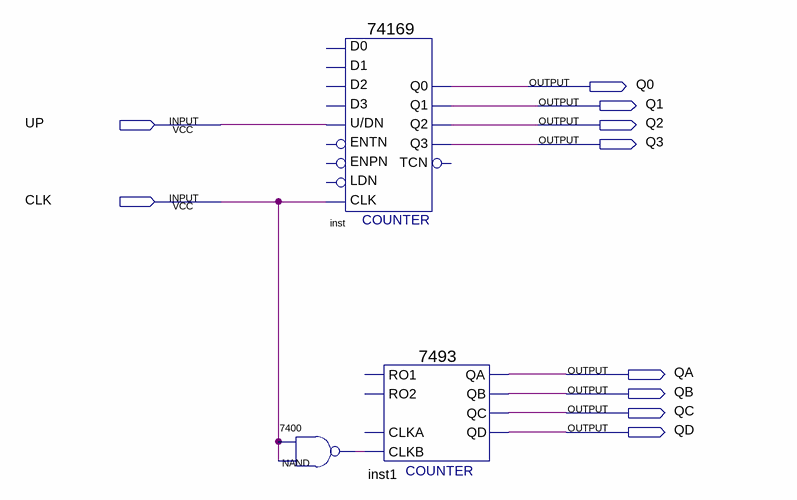
[diagram p0: schematic sheet]
// Quartus schematic Block4.bdf as structural Verilog: 3 symbols, 10 pins
module Block4 (
  input  UP,
  input  CLK,
  output Q0,
  output Q1,
  output Q2,
  output Q3,
  output QA,
  output QB,
  output QC,
  output QD
);

  wire NAND_1;

  \74169  inst (
    .\U/DN (UP), .CLK(CLK), .Q2(Q2), .Q1(Q1), .Q0(Q0), .Q3(Q3));  // open: D1, D2, D0, ENTN, D3, LDN, ENPN, TCN
  \7400  NAND (.\3 (CLK), .\2 (CLK), .\1 (NAND_1));
  \7493  inst1 (.CLKB(NAND_1), .QC(QC), .QB(QB), .QA(QA), .QD(QD));  // open: RO1, RO2, CLKA
endmodule
